# EAGLE design smb (EAGLE 6.6.0)
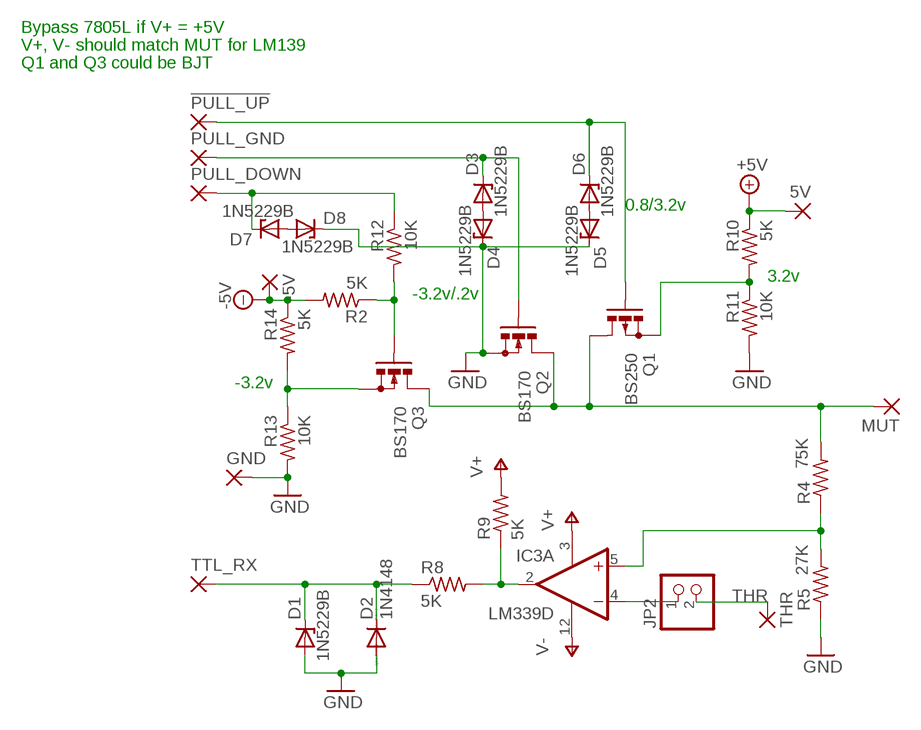
[diagram p0: schematic, sheet 1]

## Parts
5V  1,6/0,9  [1,6/0,9]
!PULL_UP  1,6/0,9  [1,6/0,9]
-5V  1,6/0,9  [1,6/0,9]
D1  1N5229B  ZENER-DIODESOD80C  [SOD80C]
D2  1N4148  DIODE-SOD80C  [SOD80C]
D3  1N5229B  ZENER-DIODESOD80C  [SOD80C]
D4  1N5229B  ZENER-DIODESOD80C  [SOD80C]
D5  1N5229B  ZENER-DIODESOD80C  [SOD80C]
D6  1N5229B  ZENER-DIODESOD80C  [SOD80C]
D7  1N5229B  ZENER-DIODESOD80C  [SOD80C]
D8  1N5229B  ZENER-DIODESOD80C  [SOD80C]
GND  1,6/0,9  [1,6/0,9]
IC3  LM339D  [SO14]
JP2  PINHD-1X2  [1X02]
MUT  1,6/0,9  [1,6/0,9]
PULL_DOWN  1,6/0,9  [1,6/0,9]
PULL_GND  1,6/0,9  [1,6/0,9]
Q1  BS250  [SOT54E]
Q2  BS170  [SOT54E]
Q3  BS170  [SOT54E]
R2  5K  R-US_M1206  [M1206]
R4  75K  R-US_M1206  [M1206]
R5  27K  R-US_M1206  [M1206]
R8  5K  R-US_M1206  [M1206]
R9  5K  R-US_M1206  [M1206]
R10  5K  R-US_M1206  [M1206]
R11  10K  R-US_M1206  [M1206]
R12  10K  R-US_M1206  [M1206]
R13  10K  R-US_M1206  [M1206]
R14  5K  R-US_M1206  [M1206]
THR  1,6/0,9  [1,6/0,9]
TTL_RX  1,6/0,9  [1,6/0,9]

## Nets
+5V: 5V.1(P) R10.1
-5V: -5V.1(P) R2.2 R14.1
GND: D1.A D2.A D4.C D5.C D8.C GND.1(P) Q2.S R5.1 R11.2 R13.2
N$1: MUT.1(P) Q1.D Q2.D Q3.D R4.2
N$2: Q3.G R2.1 R12.2
N$3: D3.C PULL_GND.1(P) Q2.G
N$4: D7.C PULL_DOWN.1(P) R12.1
N$5: Q1.S R10.2 R11.1
N$6: D5.A D6.A
N$7: IC3.5(A:+IN) R4.1 R5.2
N$8: IC3.4(A:-IN) JP2.1
N$9: IC3.2(A:OUT) R8.2 R9.1
N$10: !PULL_UP.1(P) D6.C Q1.G
N$11: D3.A D4.A
N$12: D1.C D2.C R8.1 TTL_RX.1(P)
N$15: D7.A D8.A
N$16: Q3.S R13.1 R14.2
THR: JP2.2 THR.1(P)
V+: IC3.3(P:V+) R9.2
V-: IC3.12(P:GND)
Unconnected: IC3.1(B:OUT) IC3.6(B:-IN) IC3.7(B:+IN) IC3.8(C:-IN) IC3.9(C:+IN) IC3.10(D:-IN) IC3.11(D:+IN) IC3.13(D:OUT) IC3.14(C:OUT)

## Notes on the sheet
- Bypass 7805L if V+ = +5V
- V+, V- should match MUT for LM139
- Q1 and Q3 could be BJT
- 0.8/3.2v
- 3.2v
- -3.2v/.2v
- -3.2v

## Library data of the parts
5V !PULL_UP -5V GND MUT PULL_DOWN PULL_GND THR TTL_RX = wirepad:1,6/0,9: THROUGH-HOLE PAD
D1 D3-D8 = diode:ZENER-DIODE: Z-Diode
D2 = diode:DIODE-: DIODE
IC3 = linear:LM339: Low Power Low Offset Voltage Quad Comparators with open collector; LM139/LM239/LM339/LM2901/LM3302
JP2 = pinhead:PINHD-1X2: PIN HEADER
Q1 = transistor-small-signal:BS250: P-CHANNEL MOS FET
Q2 Q3 = transistor-small-signal:BS170: N-CHANNEL MOS FET
R2 R4 R5 R8-R14 = rcl:R-US_: RESISTOR, American symbol

## Board
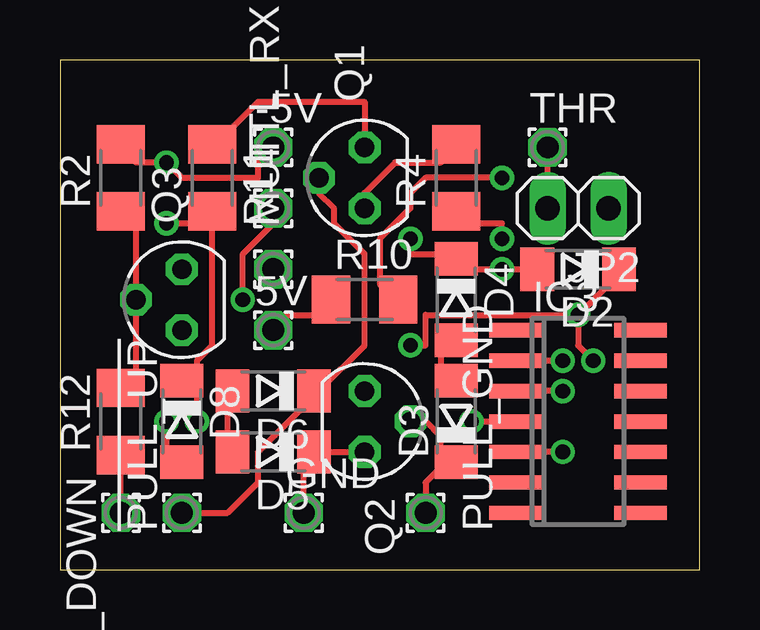
[diagram p1: board, top side]
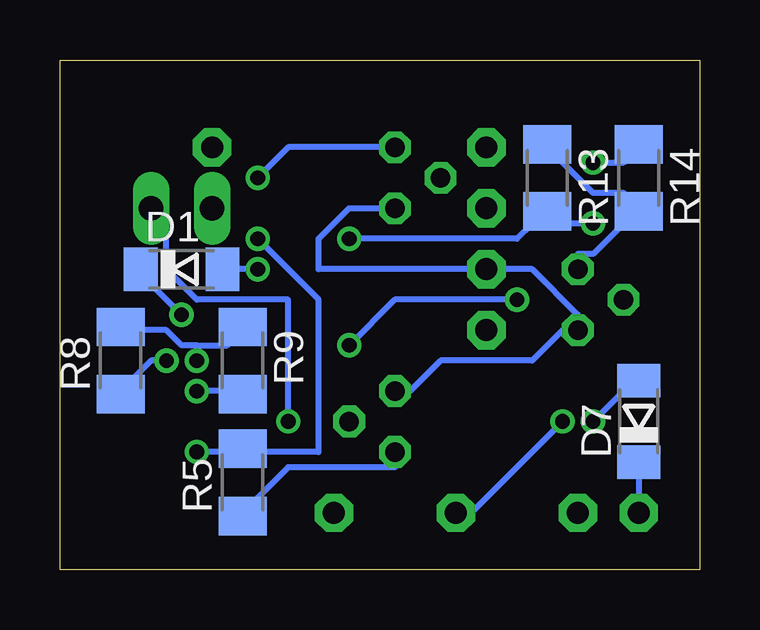
[diagram p2: board, bottom side, seen from below]

Size 26.65 x 21.26 mm. Coordinates in mm from the lower left corner, seen from the top.
Outline: 0,0 26.65,0 26.65,21.26 0,21.26 0,0
Copper layers (1*16): Top 0.035mm / dielectric 1.5mm / Bottom 0.035mm
Design rules "default *": minimum track width 10mil, minimum drill 24mil, track to track 8mil, track to pad 8mil, pad to pad 8mil, via to via 8mil, smd to smd 8mil, copper to edge 40mil, drill to drill 8mil, minimum pad ring 10mil, minimum via ring 8mil, stop-mask expansion 4mil, vias tented up to drill 0mil, thermal gap 10mil

### Footprints (pad centres in the part's own frame; a part is rotated, then mirrored left to right if it is on the bottom)
1,6/0,9 = drill 0.914 pad 1.6 octagon: 1 0,0
SOD80C = smd 1.4 x 1.8: A 1.7,0; C -1.7,0
SO14 = smd 0.6 x 2.2: 1 -3.81,-2.6; 2 -2.54,-2.6; 3 -1.27,-2.6; 4 0,-2.6; 5 1.27,-2.6; 6 2.54,-2.6; 7 3.81,-2.6; 8 3.81,2.6; 9 2.54,2.6; 10 1.27,2.6; 11 0,2.6; 12 -1.27,2.6; 13 -2.54,2.6; 14 -3.81,2.6
1X02 = drill 1.016 long: 1 -1.27,0; 2 1.27,0
SOT54E = drill 0.813 octagon: D -1.27,0; G 0,1.905; S 1.27,0
M1206 = smd 1.6 x 2: 1 -1.4,0; 2 1.4,0

### Placement (x,y rotation side)
5V  8.88,10 0 top
!PULL_UP  5.08,2.38 90 top
-5V  8.88,17.62 0 top
D1  21.59,12.54 0 bottom
D2  21.59,12.54 180 top
D3  16.51,6.18 90 top
D4  16.51,11.27 270 top
D5  8.88,4.92 180 top
D6  8.88,7.46 180 top
D7  2.54,6.18 90 bottom
D8  5.08,6.18 270 top
GND  10.15,2.38 0 top
IC3  21.59,6.18 270 top
JP2  21.59,15.08 180 top
MUT  8.88,12.54 90 top
PULL_DOWN  2.54,2.38 270 top
PULL_GND  15.23,2.38 0 top
Q1  12.69,16.35 90 top
Q2  12.69,6.18 270 top
Q3  5.08,11.27 90 top
R2  2.54,16.35 90 top
R4  16.51,16.35 90 top
R5  19.05,3.65 90 bottom
R8  24.12,8.73 90 bottom
R9  19.05,8.73 270 bottom
R10  12.69,11.27 0 top
R11  6.34,16.35 270 top
R12  2.54,6.18 90 top
R13  6.34,16.35 270 bottom
R14  2.54,16.35 270 bottom
THR  20.32,17.62 0 top
TTL_RX  8.88,15.08 90 top

### Tracks (layer width: path | path; a pad name or v marks a point on that pad's centre or on a via)
+5V
  Top 0.254: R10.1 10.79,10.63 8.88,10.63 5V.1
-5V  (via drill 0.61)
  Top 0.254: R14.1 3.17,16.98 v4.44,16.98 5.08,16.35 8.25,16.35 8.25,17.62 -5V.1
  Bottom 0.254: v4.44,16.98 3.17,16.98 R14.1
GND  (via drill 0.61)
  Top 0.254: GND.1 10.15,3.01 10.15,4.28 D5.C 10.79,4.92 12.06,4.92 Q2.S | D2.A 19.68,12.54 v18.41,12.54 17.14,12.54 D4.C 15.87,13.17 14.6,13.17 v14.6,13.81 | v4.44,14.44 5.71,14.44 R11.2 6.34,14.44 6.34,9.36 5.71,8.73 5.71,8.09 D8.C 5.71,7.46 v5.71,6.18
  Bottom 0.254: R5.1 18.41,3.01 17.14,4.28 12.69,4.28 Q2.S | v18.41,12.54 19.68,12.54 D2.A | v4.44,14.44 5.71,14.44 R11.2 6.98,14.44 7.62,13.81 v14.6,13.81 | v5.71,6.18 9.52,2.38 GND.1
N$1
  Top 0.254: R4.2 15.87,16.98 13.96,16.98 12.69,15.71 Q1.D
  Bottom 0.254: Q2.D 12.06,7.46 10.79,8.73 6.98,8.73 5.71,10 Q3.D 5.08,10.63 6.98,12.54 8.25,12.54 MUT.1 9.52,12.54 15.87,12.54 15.87,13.81 14.6,15.08 13.33,15.08 Q1.D
N$2
  Top 0.254: R12.2 3.17,8.09 3.17,10.63 Q3.G 3.17,11.9 3.17,14.44 R2.1
N$3
  Top 0.254: PULL_GND.1 15.23,3.01 15.23,3.65 15.87,4.28 D3.C 15.87,4.92 15.87,5.55 15.23,6.18 Q2.G
N$4
  Top 0.254: R12.1 2.54,4.28 2.54,3.01 PULL_DOWN.1
  Bottom 0.254: D7.C 2.54,4.28 2.54,3.01 PULL_DOWN.1
N$5  (via drill 0.61)
  Top 0.254: v18.41,16.35 15.23,16.35 14.6,15.71 14.6,15.08 13.33,13.81 13.33,11.9 R10.2 | R11.1 6.98,18.25 8.25,19.52 12.69,19.52 12.69,18.25 Q1.S
  Bottom 0.254: v18.41,16.35 17.14,17.62 13.33,17.62 Q1.S
N$6
  Top 0.254: D5.A 6.98,5.55 6.98,6.82 D6.A
N$7  (via drill 0.61)
  Top 0.254: v18.41,13.81 18.41,14.44 17.14,14.44 R4.1 | v20.95,4.92 19.68,4.92 IC3.5
  Bottom 0.254: v18.41,13.81 15.87,11.27 15.87,4.92 18.41,4.92 R5.2 19.68,4.92 v20.95,4.92
N$8  (via drill 0.61)
  Top 0.254: v17.14,6.18 18.41,6.18 IC3.4
  Bottom 0.254: v17.14,6.18 17.14,11.27 20.95,11.27 22.22,12.54 22.22,14.44 JP2.1
N$9  (via drill 0.61)
  Top 0.254: v20.95,8.73 19.68,8.73 IC3.2
  Bottom 0.254: 20.95,9.36 21.59,9.36 22.22,10 23.49,10 R8.2 | 20.95,9.36 19.68,9.36 R9.1 | v20.95,8.73 20.95,9.36
N$10
  Top 0.254: !PULL_UP.1 5.71,2.38 6.98,2.38 8.25,3.65 8.25,4.92 10.15,6.82 D6.C 10.79,7.46 12.69,9.36 12.69,13.17 11.42,14.44 11.42,15.08 10.79,15.71 Q1.G
N$11
  Top 0.254: D3.A 15.87,8.09 15.87,9.36 D4.A
N$12  (via drill 0.61)
  Top 0.254: v21.59,10.63 22.86,11.9 D2.C | v22.22,8.73 21.59,9.36 v21.59,10.63 | v7.62,11.27 7.62,13.17 8.88,14.44 TTL_RX.1 | v14.6,9.36 15.23,9.36 15.23,10.63 v21.59,10.63
  Bottom 0.254: v21.59,10.63 22.86,11.9 D2.C | v22.22,8.73 22.86,8.73 23.49,8.09 R8.1 | v7.62,11.27 12.69,11.27 v14.6,9.36
N$15  (via drill 0.61)
  Top 0.254: v4.44,6.18 4.44,4.92 D8.A
  Bottom 0.254: v4.44,6.18 3.17,7.46 D7.A
N$16
  Bottom 0.254: Q3.S 5.08,13.17 4.44,13.17 3.17,14.44 R14.2 3.17,15.71 4.44,15.71 5.71,16.98 R13.1
THR
  Top 0.254: JP2.2 20.32,16.35 20.32,16.98 THR.1
V+  (via drill 0.61)
  Top 0.254: v20.95,7.46 19.68,7.46 IC3.3
  Bottom 0.254: v20.95,7.46 19.68,7.46 R9.2